# EAGLE schematic calendar-decoders (EAGLE 7.7.0)
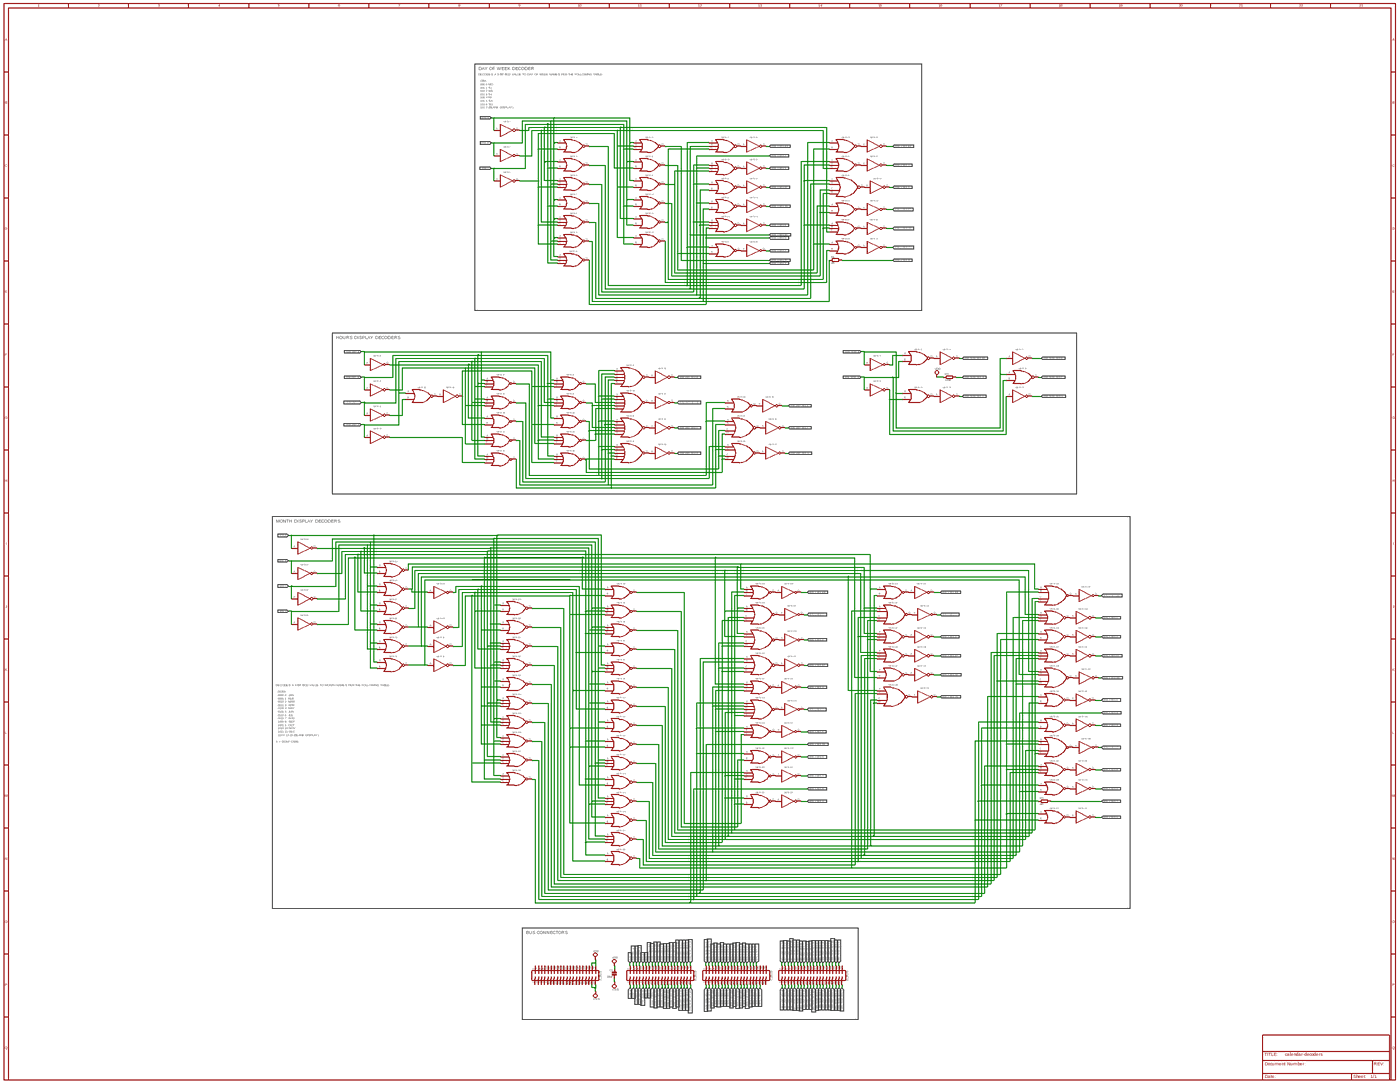
[diagram p0: schematic, sheet 1, overview]
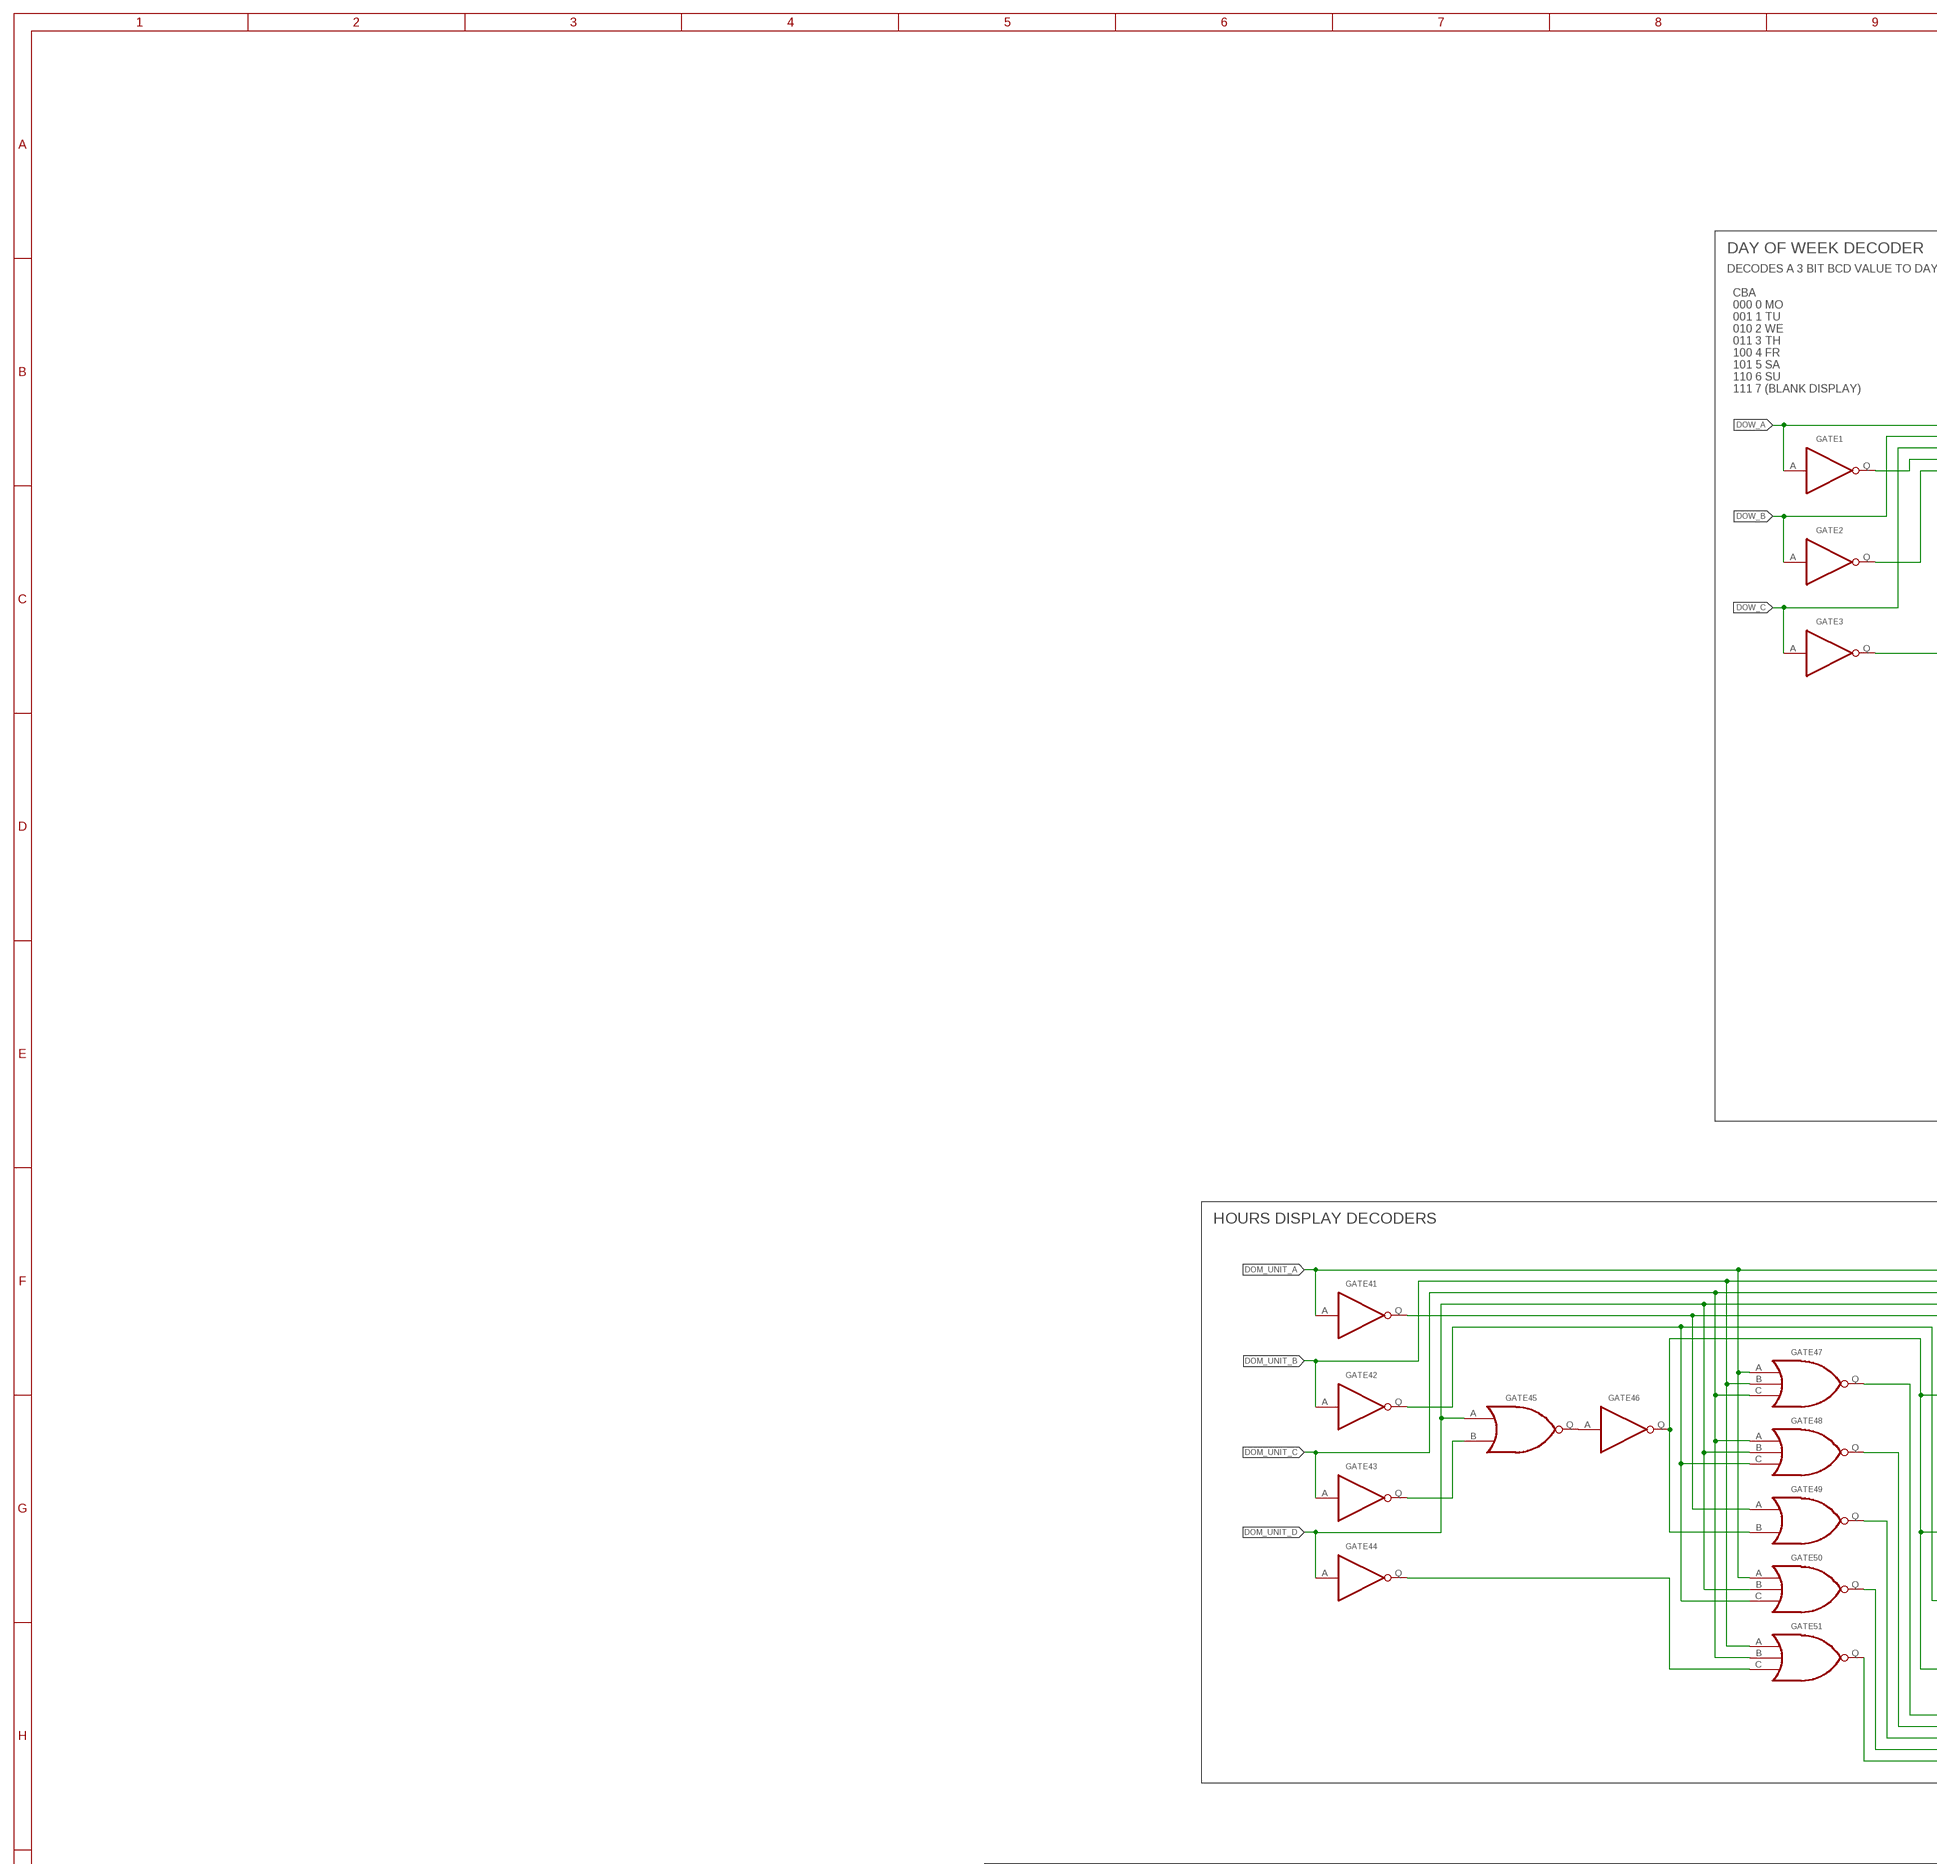
[diagram p1: schematic, sheet 1, part 1 of 6]
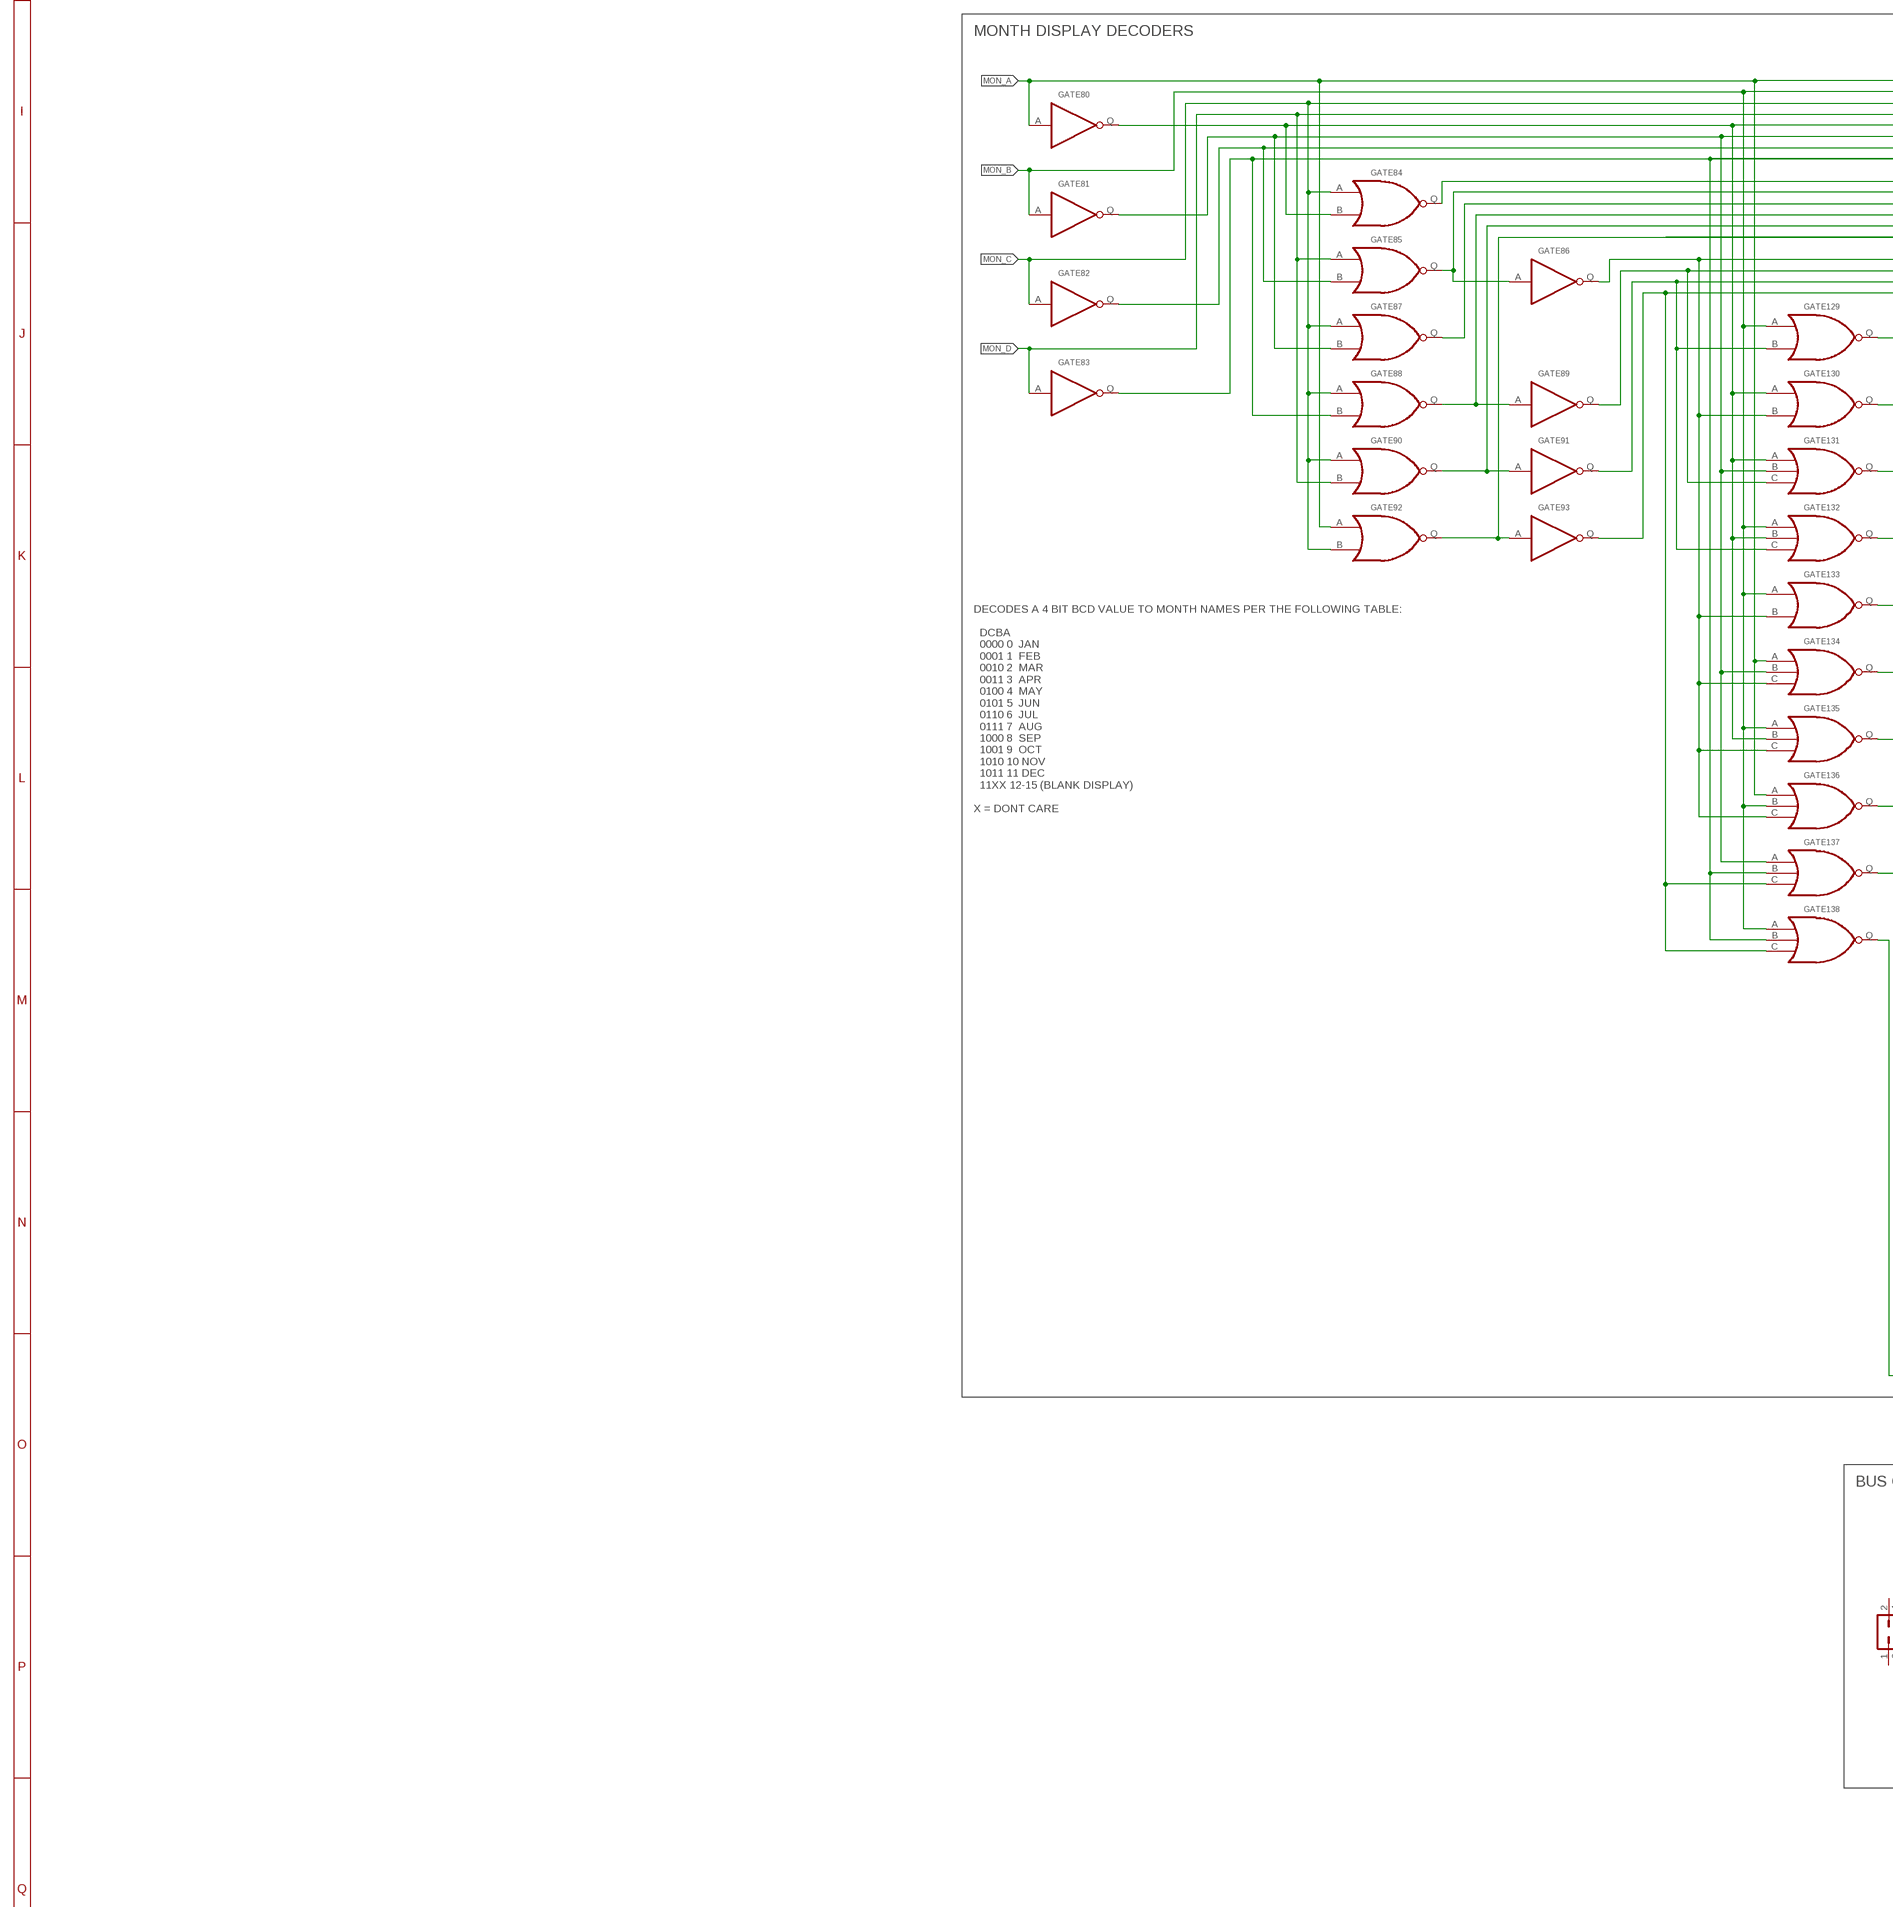
[diagram p2: schematic, sheet 1, part 2 of 6]
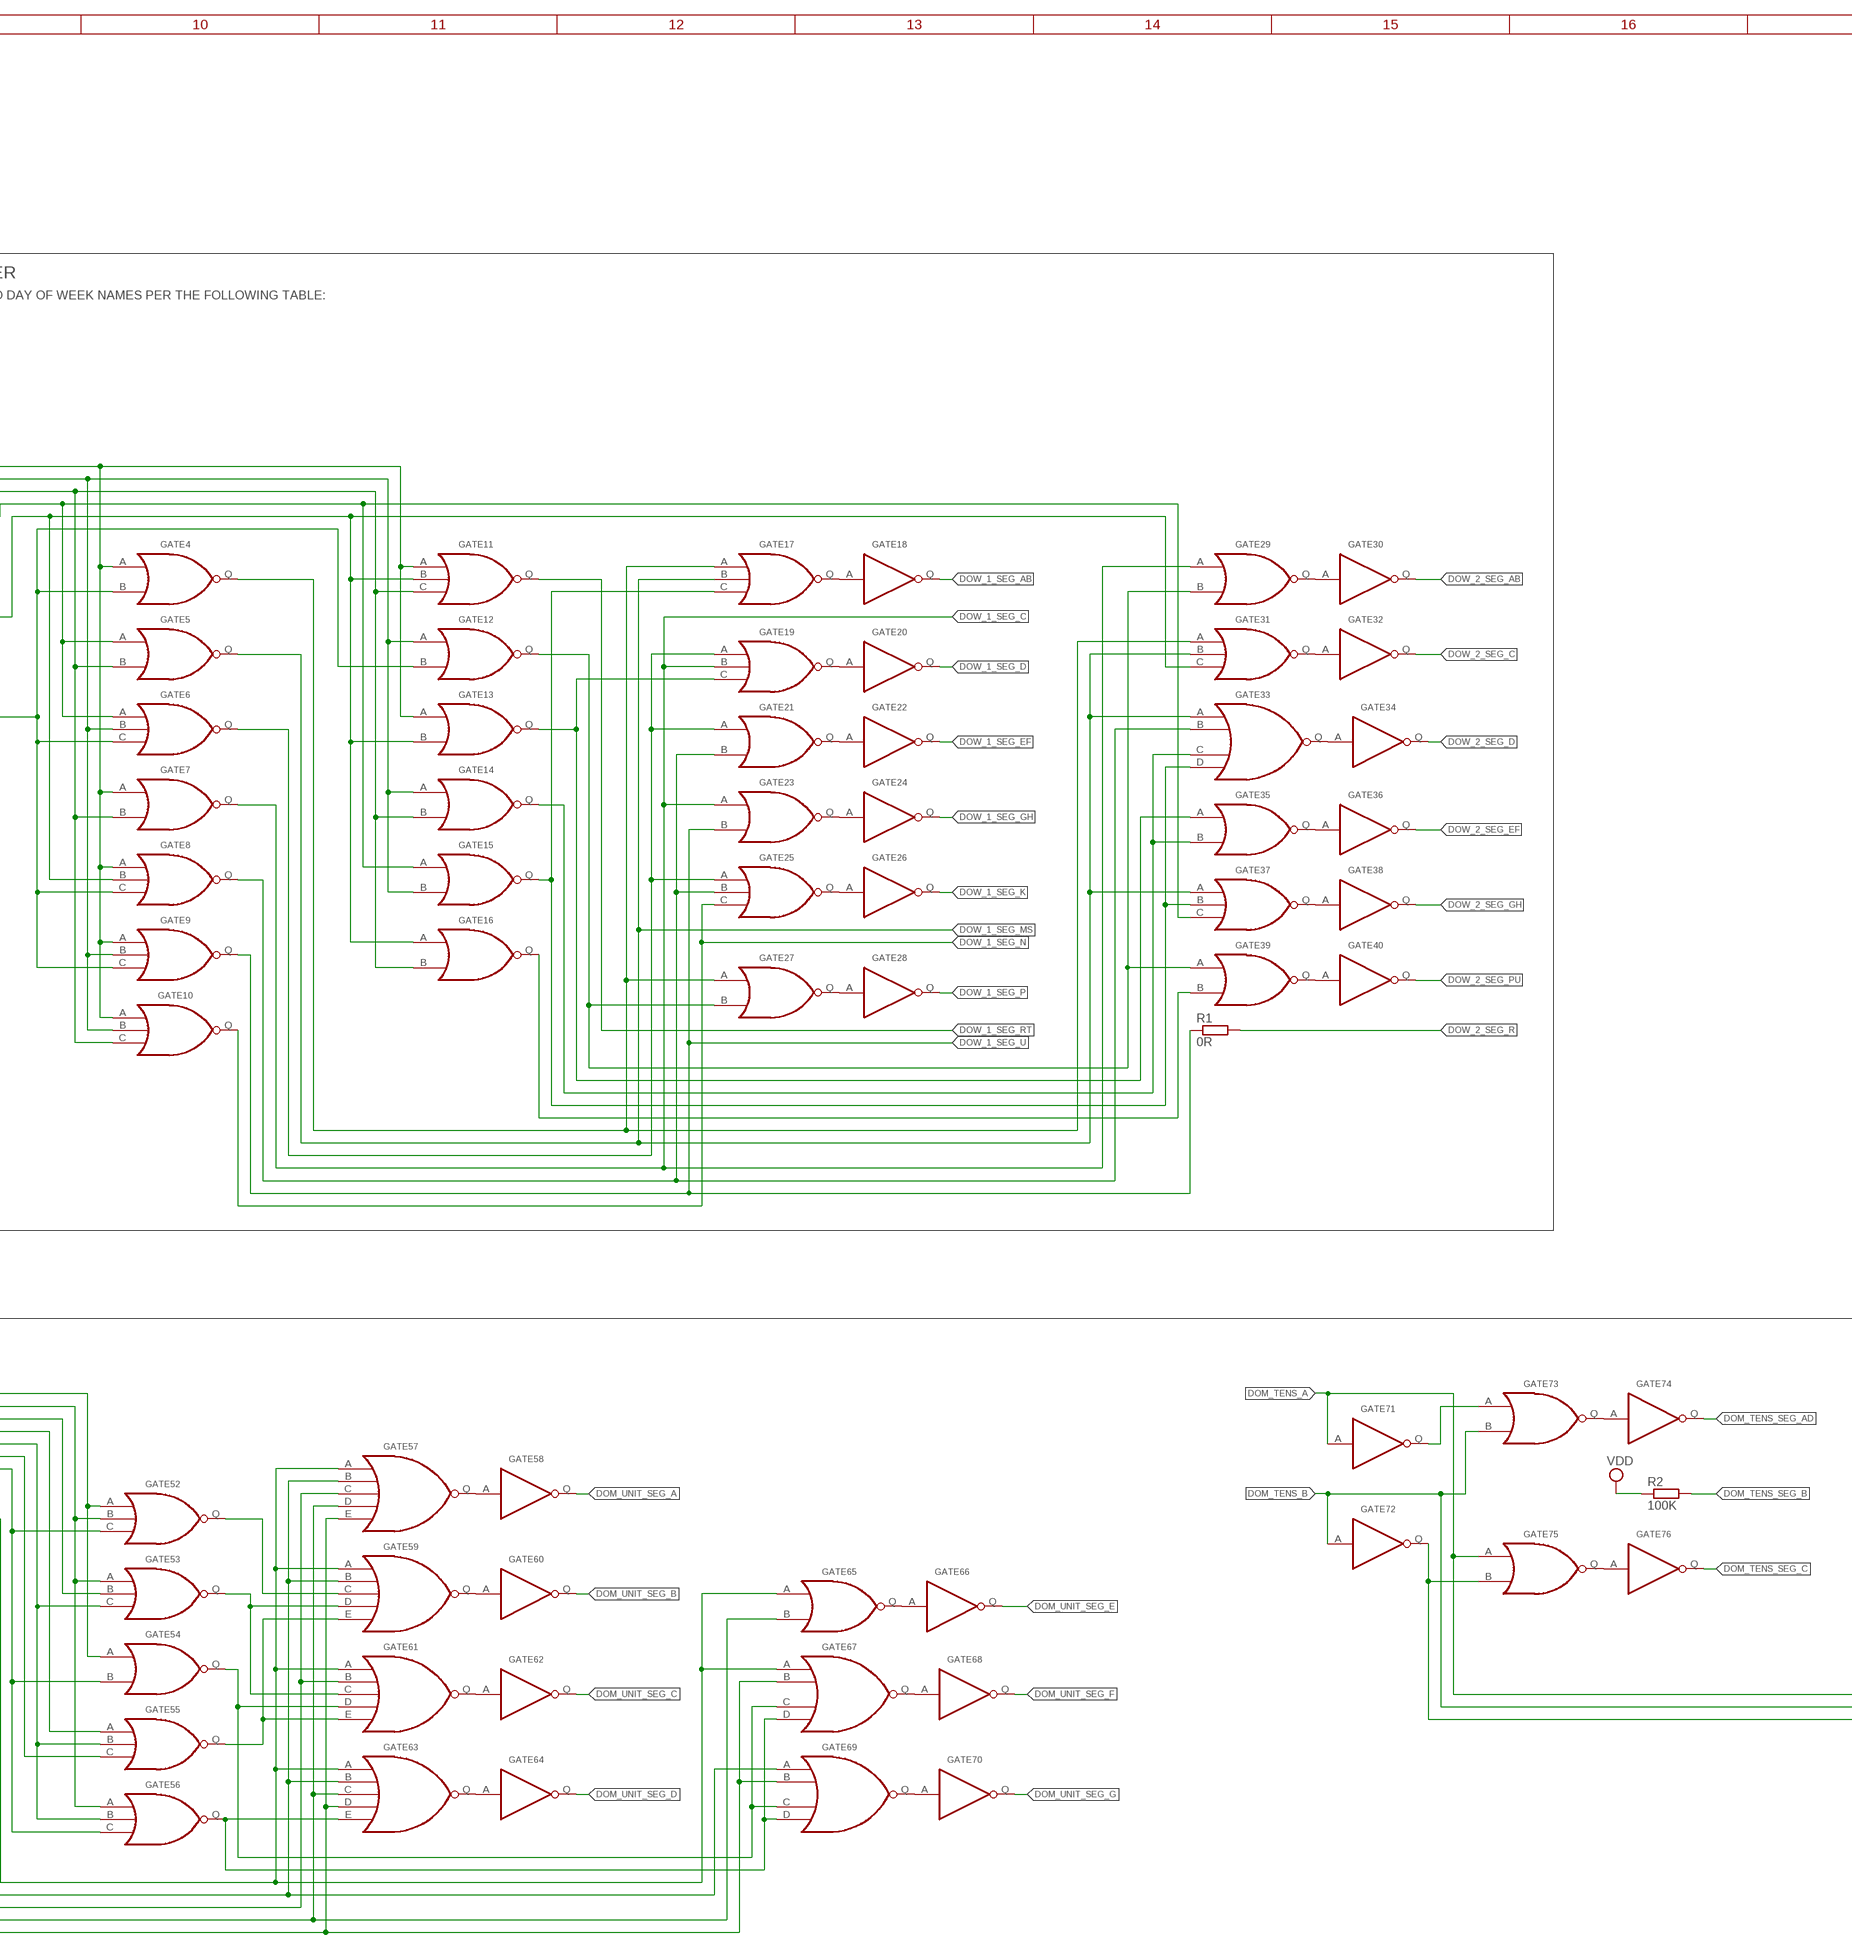
[diagram p3: schematic, sheet 1, part 3 of 6]
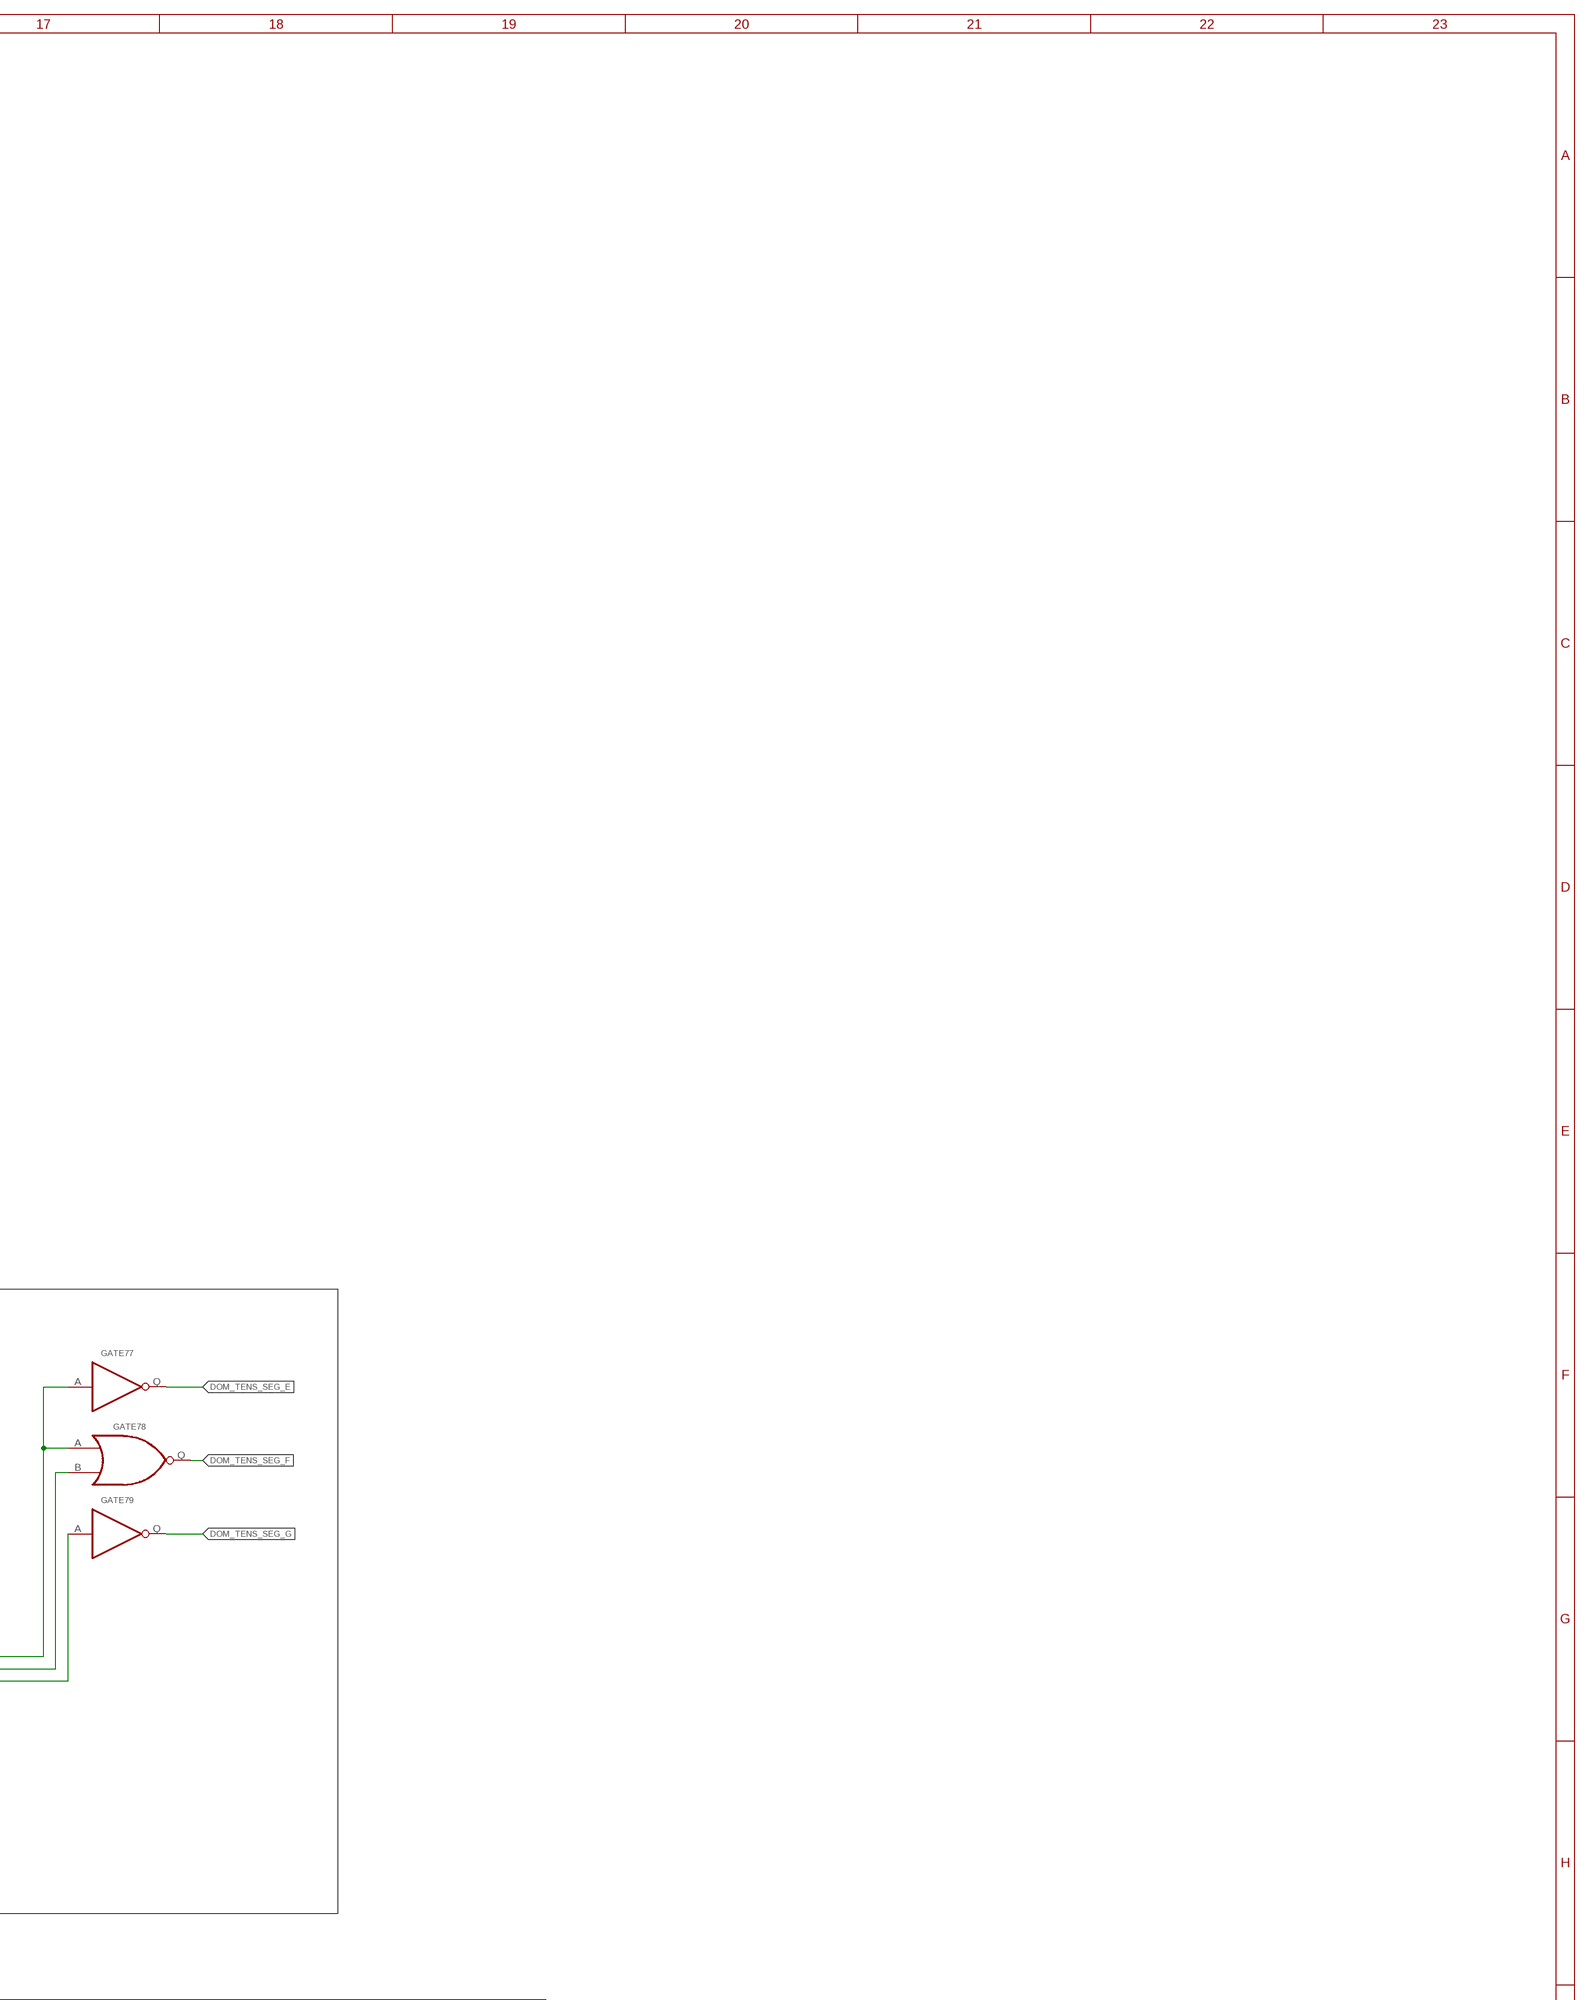
[diagram p4: schematic, sheet 1, part 4 of 6]
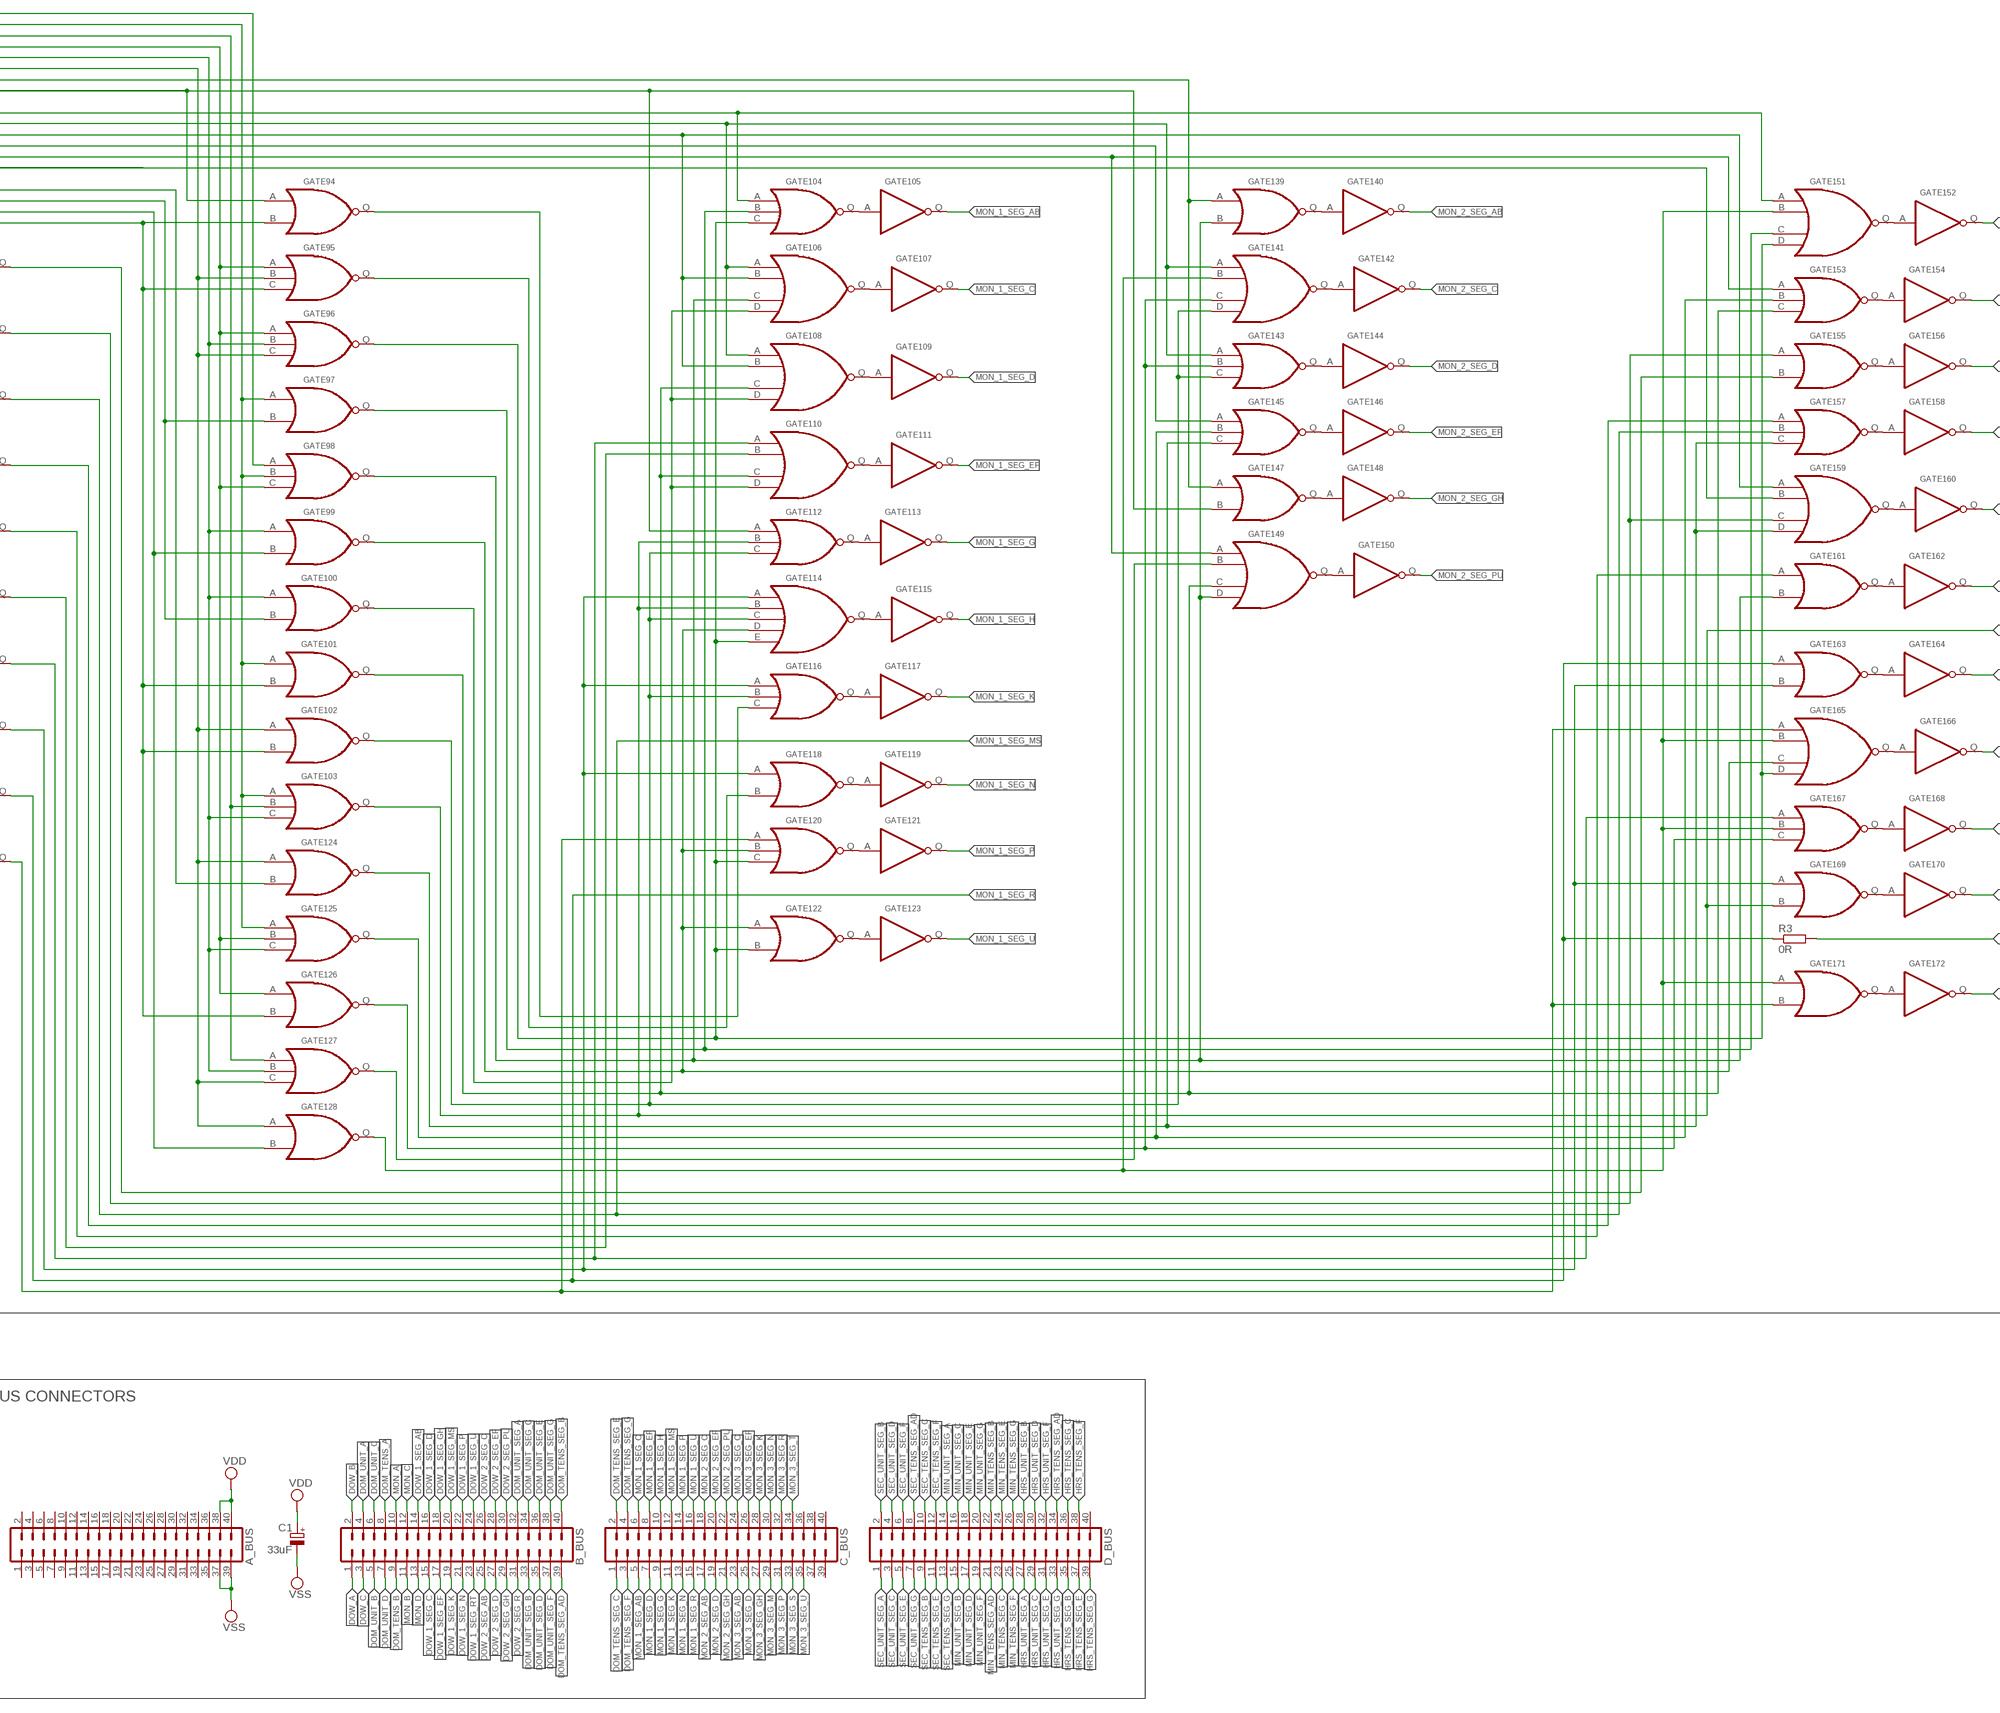
[diagram p5: schematic, sheet 1, part 5 of 6]
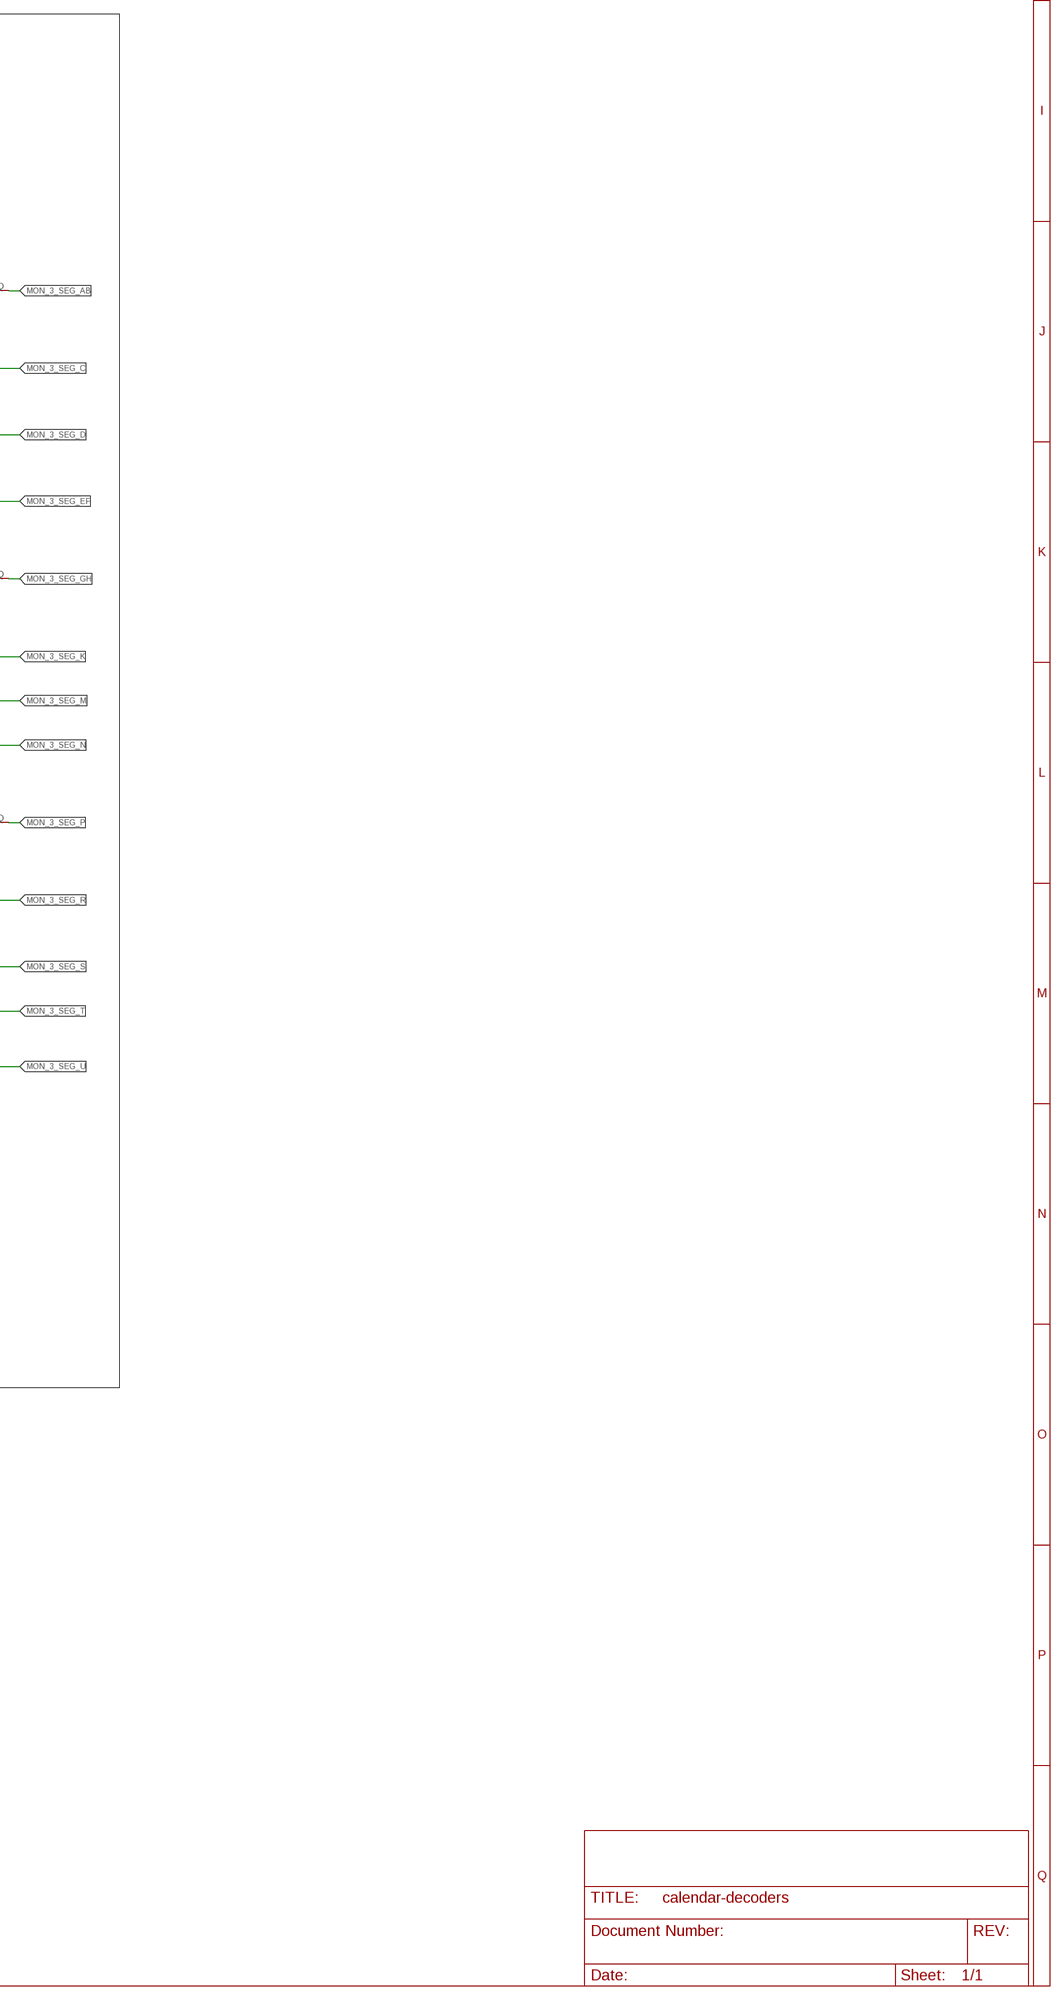
[diagram p6: schematic, sheet 1, part 6 of 6]

## Parts
A_BUS  MA20-2  [MA20-2]
B_BUS  MA20-2  [MA20-2]
C1  33uF  CPOL-EUE2.5-6  [E2,5-6]
C_BUS  MA20-2  [MA20-2]
D_BUS  MA20-2  [MA20-2]
GATE1  INVERTER  [INVERTER]
GATE2  INVERTER  [INVERTER]
GATE3  INVERTER  [INVERTER]
GATE4  2NOR  [2NOR]
GATE5  2NOR  [2NOR]
GATE6  3NOR  [3NOR]
GATE7  2NOR  [2NOR]
GATE8  3NOR  [3NOR]
GATE9  3NOR  [3NOR]
GATE10  3NOR  [3NOR]
GATE11  3NOR  [3NOR]
GATE12  2NOR  [2NOR]
GATE13  2NOR  [2NOR]
GATE14  2NOR  [2NOR]
GATE15  2NOR  [2NOR]
GATE16  2NOR  [2NOR]
GATE17  3NOR  [3NOR]
GATE18  INVERTER  [INVERTER]
GATE19  3NOR  [3NOR]
GATE20  INVERTER  [INVERTER]
GATE21  2NOR  [2NOR]
GATE22  INVERTER  [INVERTER]
GATE23  2NOR  [2NOR]
GATE24  INVERTER  [INVERTER]
GATE25  3NOR  [3NOR]
GATE26  INVERTER  [INVERTER]
GATE27  2NOR  [2NOR]
GATE28  INVERTER  [INVERTER]
GATE29  2NOR  [2NOR]
GATE30  INVERTER  [INVERTER]
GATE31  3NOR  [3NOR]
GATE32  INVERTER  [INVERTER]
GATE33  4NOR  [4NOR]
GATE34  INVERTER  [INVERTER]
GATE35  2NOR  [2NOR]
GATE36  INVERTER  [INVERTER]
GATE37  3NOR  [3NOR]
GATE38  INVERTER  [INVERTER]
GATE39  2NOR  [2NOR]
GATE40  INVERTER  [INVERTER]
GATE41  INVERTER  [INVERTER]
GATE42  INVERTER  [INVERTER]
GATE43  INVERTER  [INVERTER]
GATE44  INVERTER  [INVERTER]
GATE45  2NOR  [2NOR]
GATE46  INVERTER  [INVERTER]
GATE47  3NOR  [3NOR]
GATE48  3NOR  [3NOR]
GATE49  2NOR  [2NOR]
GATE50  3NOR  [3NOR]
GATE51  3NOR  [3NOR]
GATE52  3NOR  [3NOR]
GATE53  3NOR  [3NOR]
GATE54  2NOR  [2NOR]
GATE55  3NOR  [3NOR]
GATE56  3NOR  [3NOR]
GATE57  5NOR  [5NOR]
GATE58  INVERTER  [INVERTER]
GATE59  5NOR  [5NOR]
GATE60  INVERTER  [INVERTER]
GATE61  5NOR  [5NOR]
GATE62  INVERTER  [INVERTER]
GATE63  5NOR  [5NOR]
GATE64  INVERTER  [INVERTER]
GATE65  2NOR  [2NOR]
GATE66  INVERTER  [INVERTER]
GATE67  4NOR  [4NOR]
GATE68  INVERTER  [INVERTER]
GATE69  4NOR  [4NOR]
GATE70  INVERTER  [INVERTER]
GATE71  INVERTER  [INVERTER]
GATE72  INVERTER  [INVERTER]
GATE73  2NOR  [2NOR]
GATE74  INVERTER  [INVERTER]
GATE75  2NOR  [2NOR]
GATE76  INVERTER  [INVERTER]
GATE77  INVERTER  [INVERTER]
GATE78  2NOR  [2NOR]
GATE79  INVERTER  [INVERTER]
GATE80  INVERTER  [INVERTER]
GATE81  INVERTER  [INVERTER]
GATE82  INVERTER  [INVERTER]
GATE83  INVERTER  [INVERTER]
GATE84  2NOR  [2NOR]
GATE85  2NOR  [2NOR]
GATE86  INVERTER  [INVERTER]
GATE87  2NOR  [2NOR]
GATE88  2NOR  [2NOR]
GATE89  INVERTER  [INVERTER]
GATE90  2NOR  [2NOR]
GATE91  INVERTER  [INVERTER]
GATE92  2NOR  [2NOR]
GATE93  INVERTER  [INVERTER]
GATE94  2NOR  [2NOR]
GATE95  3NOR  [3NOR]
GATE96  3NOR  [3NOR]
GATE97  2NOR  [2NOR]
GATE98  3NOR  [3NOR]
GATE99  2NOR  [2NOR]
GATE100  2NOR  [2NOR]
GATE101  2NOR  [2NOR]
GATE102  2NOR  [2NOR]
GATE103  3NOR  [3NOR]
GATE104  3NOR  [3NOR]
GATE105  INVERTER  [INVERTER]
GATE106  4NOR  [4NOR]
GATE107  INVERTER  [INVERTER]
GATE108  4NOR  [4NOR]
GATE109  INVERTER  [INVERTER]
GATE110  4NOR  [4NOR]
GATE111  INVERTER  [INVERTER]
GATE112  3NOR  [3NOR]
GATE113  INVERTER  [INVERTER]
GATE114  5NOR  [5NOR]
GATE115  INVERTER  [INVERTER]
GATE116  3NOR  [3NOR]
GATE117  INVERTER  [INVERTER]
GATE118  2NOR  [2NOR]
GATE119  INVERTER  [INVERTER]
GATE120  3NOR  [3NOR]
GATE121  INVERTER  [INVERTER]
GATE122  2NOR  [2NOR]
GATE123  INVERTER  [INVERTER]
GATE124  2NOR  [2NOR]
GATE125  3NOR  [3NOR]
GATE126  2NOR  [2NOR]
GATE127  3NOR  [3NOR]
GATE128  2NOR  [2NOR]
GATE129  2NOR  [2NOR]
GATE130  2NOR  [2NOR]
GATE131  3NOR  [3NOR]
GATE132  3NOR  [3NOR]
GATE133  2NOR  [2NOR]
GATE134  3NOR  [3NOR]
GATE135  3NOR  [3NOR]
GATE136  3NOR  [3NOR]
GATE137  3NOR  [3NOR]
GATE138  3NOR  [3NOR]
GATE139  2NOR  [2NOR]
GATE140  INVERTER  [INVERTER]
GATE141  4NOR  [4NOR]
GATE142  INVERTER  [INVERTER]
GATE143  3NOR  [3NOR]
GATE144  INVERTER  [INVERTER]
GATE145  3NOR  [3NOR]
GATE146  INVERTER  [INVERTER]
GATE147  2NOR  [2NOR]
GATE148  INVERTER  [INVERTER]
GATE149  4NOR  [4NOR]
GATE150  INVERTER  [INVERTER]
GATE151  4NOR  [4NOR]
GATE152  INVERTER  [INVERTER]
GATE153  3NOR  [3NOR]
GATE154  INVERTER  [INVERTER]
GATE155  2NOR  [2NOR]
GATE156  INVERTER  [INVERTER]
GATE157  3NOR  [3NOR]
GATE158  INVERTER  [INVERTER]
GATE159  4NOR  [4NOR]
GATE160  INVERTER  [INVERTER]
GATE161  2NOR  [2NOR]
GATE162  INVERTER  [INVERTER]
GATE163  2NOR  [2NOR]
GATE164  INVERTER  [INVERTER]
GATE165  4NOR  [4NOR]
GATE166  INVERTER  [INVERTER]
GATE167  3NOR  [3NOR]
GATE168  INVERTER  [INVERTER]
GATE169  2NOR  [2NOR]
GATE170  INVERTER  [INVERTER]
GATE171  2NOR  [2NOR]
GATE172  INVERTER  [INVERTER]
R1  0R  R-EU_0207/2V  [0207/2V]
R2  100K  R-EU_0207/2V  [0207/2V]
R3  0R  R-EU_0207/2V  [0207/2V]

## Nets
DOM_TENS_A: B_BUS.8 GATE71.A GATE75.A GATE77.A GATE78.A
DOM_TENS_B: B_BUS.9 GATE72.A GATE73.B GATE78.B
DOM_TENS_SEG_AD: B_BUS.39 GATE74.Q
DOM_TENS_SEG_B: B_BUS.40 R2.2
DOM_TENS_SEG_C: C_BUS.1 GATE76.Q
DOM_TENS_SEG_E: C_BUS.2 GATE77.Q
DOM_TENS_SEG_F: C_BUS.3 GATE78.Q
DOM_TENS_SEG_G: C_BUS.4 GATE79.Q
DOM_UNIT_A: B_BUS.4 GATE41.A GATE47.A GATE50.A GATE52.A GATE54.A
DOM_UNIT_B: B_BUS.5 GATE42.A GATE47.B GATE51.A GATE52.B GATE53.A GATE56.A
DOM_UNIT_C: B_BUS.6 GATE43.A GATE47.C GATE48.A GATE51.B GATE53.B
DOM_UNIT_D: B_BUS.7 GATE44.A GATE45.A GATE48.B GATE50.B GATE55.A
DOM_UNIT_SEG_A: B_BUS.32 GATE58.Q
DOM_UNIT_SEG_B: B_BUS.33 GATE60.Q
DOM_UNIT_SEG_C: B_BUS.34 GATE62.Q
DOM_UNIT_SEG_D: B_BUS.35 GATE64.Q
DOM_UNIT_SEG_E: B_BUS.36 GATE66.Q
DOM_UNIT_SEG_F: B_BUS.37 GATE68.Q
DOM_UNIT_SEG_G: B_BUS.38 GATE70.Q
DOW_1_SEG_AB: B_BUS.14 GATE18.Q
DOW_1_SEG_C: B_BUS.15 GATE7.Q GATE19.B GATE23.A GATE29.A
DOW_1_SEG_D: B_BUS.16 GATE20.Q
DOW_1_SEG_EF: B_BUS.17 GATE22.Q
DOW_1_SEG_GH: B_BUS.18 GATE24.Q
DOW_1_SEG_K: B_BUS.19 GATE26.Q
DOW_1_SEG_MS: B_BUS.20 GATE5.Q GATE17.B GATE31.B GATE33.A GATE37.A
DOW_1_SEG_N: B_BUS.21 GATE10.Q GATE25.C
DOW_1_SEG_P: B_BUS.22 GATE28.Q
DOW_1_SEG_RT: B_BUS.23 GATE11.Q
DOW_1_SEG_U: B_BUS.24 GATE9.Q GATE23.B R1.1
DOW_2_SEG_AB: B_BUS.25 GATE30.Q
DOW_2_SEG_C: B_BUS.26 GATE32.Q
DOW_2_SEG_D: B_BUS.27 GATE34.Q
DOW_2_SEG_EF: B_BUS.28 GATE36.Q
DOW_2_SEG_GH: B_BUS.29 GATE38.Q
DOW_2_SEG_PU: B_BUS.30 GATE40.Q
DOW_2_SEG_R: B_BUS.31 R1.2
DOW_A: B_BUS.1 GATE1.A GATE4.A GATE7.A GATE8.A GATE9.A GATE10.A GATE11.A GATE13.A
DOW_B: B_BUS.2 GATE2.A GATE6.B GATE9.B GATE10.B GATE12.A GATE14.A GATE15.B
DOW_C: B_BUS.3 GATE3.A GATE5.B GATE7.B GATE10.C GATE11.C GATE14.B GATE16.B
HRS_TENS_SEG_AD: D_BUS.34
HRS_TENS_SEG_B: D_BUS.35
HRS_TENS_SEG_C: D_BUS.36
HRS_TENS_SEG_E: D_BUS.37
HRS_TENS_SEG_F: D_BUS.38
HRS_TENS_SEG_G: D_BUS.39
HRS_UNIT_SEG_A: D_BUS.27
HRS_UNIT_SEG_B: D_BUS.28
HRS_UNIT_SEG_C: D_BUS.29
HRS_UNIT_SEG_D: D_BUS.30
HRS_UNIT_SEG_E: D_BUS.31
HRS_UNIT_SEG_F: D_BUS.32
HRS_UNIT_SEG_G: D_BUS.33
MIN_TENS_SEG_AD: D_BUS.21
MIN_TENS_SEG_B: D_BUS.22
MIN_TENS_SEG_C: D_BUS.23
MIN_TENS_SEG_E: D_BUS.24
MIN_TENS_SEG_F: D_BUS.25
MIN_TENS_SEG_G: D_BUS.26
MIN_UNIT_SEG_A: D_BUS.14
MIN_UNIT_SEG_B: D_BUS.15
MIN_UNIT_SEG_C: D_BUS.16
MIN_UNIT_SEG_D: D_BUS.17
MIN_UNIT_SEG_E: D_BUS.18
MIN_UNIT_SEG_F: D_BUS.19
MIN_UNIT_SEG_G: D_BUS.20
MON_1_SEG_AB: C_BUS.5 GATE105.Q
MON_1_SEG_C: C_BUS.6 GATE107.Q
MON_1_SEG_D: C_BUS.7 GATE109.Q
MON_1_SEG_EF: C_BUS.8 GATE111.Q
MON_1_SEG_G: C_BUS.9 GATE113.Q
MON_1_SEG_H: C_BUS.10 GATE115.Q
MON_1_SEG_K: C_BUS.11 GATE117.Q
MON_1_SEG_MS: C_BUS.12 GATE131.Q GATE157.B
MON_1_SEG_N: C_BUS.13 GATE119.Q
MON_1_SEG_P: C_BUS.14 GATE121.Q
MON_1_SEG_R: C_BUS.15 GATE137.Q GATE163.A R3.1
MON_1_SEG_U: C_BUS.16 GATE123.Q
MON_2_SEG_AB: C_BUS.17 GATE140.Q
MON_2_SEG_C: C_BUS.18 GATE142.Q
MON_2_SEG_D: C_BUS.19 GATE144.Q
MON_2_SEG_EF: C_BUS.20 GATE146.Q
MON_2_SEG_GH: C_BUS.21 GATE148.Q
MON_2_SEG_PU: C_BUS.22 GATE150.Q
MON_3_SEG_AB: C_BUS.23 GATE152.Q
MON_3_SEG_C: C_BUS.24 GATE154.Q
MON_3_SEG_D: C_BUS.25 GATE156.Q
MON_3_SEG_EF: C_BUS.26 GATE158.Q
MON_3_SEG_GH: C_BUS.27 GATE160.Q
MON_3_SEG_K: C_BUS.28 GATE162.Q
MON_3_SEG_M: C_BUS.29 GATE103.Q GATE112.B GATE114.B GATE169.B
MON_3_SEG_N: C_BUS.30 GATE164.Q
MON_3_SEG_P: C_BUS.31 GATE166.Q
MON_3_SEG_R: C_BUS.32 GATE168.Q
MON_3_SEG_S: C_BUS.33 GATE170.Q
MON_3_SEG_T: C_BUS.34 R3.2
MON_3_SEG_U: C_BUS.35 GATE172.Q
MON_A: B_BUS.10 GATE80.A GATE92.A GATE98.A GATE134.A GATE136.A
MON_B: B_BUS.11 GATE81.A GATE97.A GATE98.B GATE101.A GATE103.A GATE125.A GATE129.A GATE132.A GATE133.A GATE135.A GATE136.B GATE138.A
MON_C: B_BUS.12 GATE82.A GATE84.A GATE87.A GATE88.A GATE90.A GATE92.B GATE103.B GATE127.A
MON_D: B_BUS.13 GATE83.A GATE85.A GATE90.B GATE95.A GATE96.A GATE98.C GATE125.B GATE126.A
N$1: GATE3.Q GATE4.B GATE6.C GATE8.C GATE9.C GATE12.B
N$2: GATE45.Q GATE46.A
N$3: GATE57.Q GATE58.A
N$4: GATE1.Q GATE5.A GATE6.A GATE15.A GATE37.C
N$5: GATE2.Q GATE8.B GATE11.B GATE13.B GATE16.A GATE31.C
N$6: GATE8.Q GATE21.B GATE25.B GATE33.B
N$7: GATE12.Q GATE27.B GATE29.B GATE39.A
N$8: GATE6.Q GATE19.A GATE21.A GATE25.A
N$9: GATE59.Q GATE60.A
N$10: GATE4.Q GATE17.A GATE27.A GATE31.A
N$11: GATE16.Q GATE39.B
N$12: GATE15.Q GATE17.C GATE33.D GATE37.B
N$13: GATE14.Q GATE33.C GATE35.B
N$14: GATE13.Q GATE19.C GATE35.A
N$15: GATE61.Q GATE62.A
N$16: GATE63.Q GATE64.A
N$17: GATE17.Q GATE18.A
N$18: GATE19.Q GATE20.A
N$19: GATE21.Q GATE22.A
N$20: GATE23.Q GATE24.A
N$21: GATE25.Q GATE26.A
N$22: GATE27.Q GATE28.A
N$23: GATE29.Q GATE30.A
N$24: GATE31.Q GATE32.A
N$25: GATE33.Q GATE34.A
N$26: GATE35.Q GATE36.A
N$27: GATE37.Q GATE38.A
N$28: GATE39.Q GATE40.A
N$29: GATE65.Q GATE66.A
N$30: GATE67.Q GATE68.A
N$31: GATE69.Q GATE70.A
N$32: GATE73.Q GATE74.A
N$33: GATE75.Q GATE76.A
N$34: GATE93.Q GATE94.B GATE95.C GATE101.B GATE102.B GATE126.B GATE137.C GATE138.C
N$35: GATE91.Q GATE99.B GATE128.B GATE129.B GATE132.C
N$36: GATE90.Q GATE91.A GATE149.A GATE153.A
N$37: GATE92.Q GATE93.A GATE159.B
N$38: GATE104.Q GATE105.A
N$39: GATE106.Q GATE107.A
N$40: GATE108.Q GATE109.A
N$41: GATE110.Q GATE111.A
N$42: GATE80.Q GATE84.B GATE96.B GATE99.A GATE100.A GATE103.C GATE125.C GATE127.B GATE130.A GATE131.A GATE132.B GATE135.B
N$43: GATE81.Q GATE87.B GATE95.B GATE96.C GATE102.A GATE124.A GATE127.C GATE128.A GATE131.B GATE134.B GATE137.A
N$44: GATE82.Q GATE85.B GATE139.A GATE147.A
N$45: GATE83.Q GATE88.B GATE94.A GATE112.A GATE137.B GATE138.B GATE147.B
N$46: GATE84.Q GATE104.A GATE151.A
N$47: GATE85.Q GATE86.A GATE106.A GATE108.A GATE141.A GATE143.A
N$48: GATE87.Q GATE106.B GATE108.B GATE159.A
N$49: GATE88.Q GATE89.A GATE145.A
N$51: GATE86.Q GATE124.B GATE130.B GATE133.B GATE134.C GATE135.C GATE136.C
N$52: GATE112.Q GATE113.A
N$53: GATE114.Q GATE115.A
N$54: GATE116.Q GATE117.A
N$55: GATE118.Q GATE119.A
N$56: GATE120.Q GATE121.A
N$57: GATE122.Q GATE123.A
N$58: GATE124.Q GATE145.C GATE157.C GATE159.D
N$59: GATE125.Q GATE145.B GATE153.B
N$60: GATE126.Q GATE141.C GATE143.B GATE167.C
N$61: GATE127.Q GATE149.B
N$62: GATE128.Q GATE141.B GATE151.B GATE165.B GATE167.B GATE171.A
N$63: GATE120.A GATE138.Q GATE165.A GATE171.B
N$64: GATE89.Q GATE97.B GATE100.B GATE131.C
N$65: GATE114.A GATE116.A GATE118.A GATE136.Q GATE163.B GATE169.A
N$66: GATE110.A GATE135.Q GATE167.A
N$67: GATE110.B GATE134.Q
N$68: GATE133.Q GATE161.A
N$69: GATE132.Q GATE157.A
N$71: GATE102.Q GATE112.C GATE114.C GATE116.B GATE141.D GATE143.C
N$72: GATE101.Q GATE108.C GATE110.C GATE149.C GATE153.C
N$73: GATE100.Q GATE106.D GATE108.D GATE110.D
N$74: GATE99.Q GATE114.D GATE120.B GATE122.A GATE165.C
N$75: GATE98.Q GATE106.C GATE139.B GATE149.D GATE161.B
N$76: GATE97.Q GATE104.B GATE151.C
N$77: GATE96.Q GATE104.C GATE114.E GATE120.C GATE122.B GATE151.D GATE165.D
N$78: GATE95.Q GATE118.B
N$79: GATE94.Q GATE116.C
N$80: GATE151.Q GATE152.A
N$81: GATE130.Q GATE155.A GATE159.C
N$82: GATE129.Q GATE155.B
N$83: GATE139.Q GATE140.A
N$84: GATE141.Q GATE142.A
N$85: GATE41.Q GATE49.A GATE53.C GATE55.B GATE56.B
N$86: GATE42.Q GATE48.C GATE50.C GATE55.C
N$87: GATE43.Q GATE45.B
N$88: GATE44.Q GATE51.C
N$89: GATE143.Q GATE144.A
N$90: GATE46.Q GATE49.B GATE52.C GATE54.B GATE56.C
N$91: GATE51.Q GATE57.E GATE63.D GATE67.B GATE69.B
N$92: GATE50.Q GATE57.D GATE63.C GATE65.B
N$93: GATE49.Q GATE57.C GATE61.B
N$94: GATE48.Q GATE57.B GATE59.B GATE63.B GATE69.A
N$95: GATE47.Q GATE57.A GATE59.A GATE61.A GATE63.A GATE65.A GATE67.A
N$96: GATE53.Q GATE59.D GATE61.C
N$97: GATE54.Q GATE61.D GATE67.C GATE69.C
N$98: GATE55.Q GATE59.E GATE61.E
N$99: GATE56.Q GATE63.E GATE67.D GATE69.D
N$100: GATE52.Q GATE59.C
N$101: GATE145.Q GATE146.A
N$102: GATE147.Q GATE148.A
N$103: GATE149.Q GATE150.A
N$104: GATE153.Q GATE154.A
N$105: GATE155.Q GATE156.A
N$106: GATE157.Q GATE158.A
N$107: GATE159.Q GATE160.A
N$108: GATE71.Q GATE73.A
N$109: GATE72.Q GATE75.B GATE79.A
N$110: GATE161.Q GATE162.A
N$111: GATE163.Q GATE164.A
N$112: GATE165.Q GATE166.A
N$113: GATE167.Q GATE168.A
N$114: GATE169.Q GATE170.A
N$115: GATE171.Q GATE172.A
SEC_TENS_SEG_AD: D_BUS.8
SEC_TENS_SEG_B: D_BUS.9
SEC_TENS_SEG_C: D_BUS.10
SEC_TENS_SEG_E: D_BUS.11
SEC_TENS_SEG_F: D_BUS.12
SEC_TENS_SEG_G: D_BUS.13
SEC_UNIT_SEG_A: D_BUS.1
SEC_UNIT_SEG_B: D_BUS.2
SEC_UNIT_SEG_C: D_BUS.3
SEC_UNIT_SEG_D: D_BUS.4
SEC_UNIT_SEG_E: D_BUS.5
SEC_UNIT_SEG_F: D_BUS.6
SEC_UNIT_SEG_G: D_BUS.7
VDD: A_BUS.38 A_BUS.40 C1.+ R2.1
VSS: A_BUS.37 A_BUS.39 C1.-
Unconnected: A_BUS.1 A_BUS.2 A_BUS.3 A_BUS.4 A_BUS.5 A_BUS.6 A_BUS.7 A_BUS.8 A_BUS.9 A_BUS.10 A_BUS.11 A_BUS.12 A_BUS.13 A_BUS.14 A_BUS.15 A_BUS.16 A_BUS.17 A_BUS.18 A_BUS.19 A_BUS.20 A_BUS.21 A_BUS.22 A_BUS.23 A_BUS.24 A_BUS.25 A_BUS.26 A_BUS.27 A_BUS.28 A_BUS.29 A_BUS.30 A_BUS.31 A_BUS.32 A_BUS.33 A_BUS.34 A_BUS.35 A_BUS.36 C_BUS.36 C_BUS.37 C_BUS.38 C_BUS.39 C_BUS.40 D_BUS.40

## Notes on the sheet
- DAY OF WEEK DECODER
- DECODES A 3 BIT BCD VALUE TO DAY OF WEEK NAMES PER THE FOLLOWING TABLE:
  
    CBA
    000 0 MO
    001 1 TU
    010 2 WE
    011 3 TH
    100 4 FR
    101 5 SA
    110 6 SU
    111 7 (BLANK DISPLAY)
- HOURS DISPLAY DECODERS
- MONTH DISPLAY DECODERS
- DECODES A 4 BIT BCD VALUE TO MONTH NAMES PER THE FOLLOWING TABLE:
  
    DCBA
    0000 0  JAN
    0001 1  FEB
    0010 2  MAR
    0011 3  APR
    0100 4  MAY
    0101 5  JUN
    0110 6  JUL
    0111 7  AUG
    1000 8  SEP
    1001 9  OCT
    1010 10 NOV
    1011 11 DEC
    11XX 12-15 (BLANK DISPLAY)
  
  X = DONT CARE
- BUS CONNECTORS

## Library data of the parts
A_BUS B_BUS C_BUS D_BUS = con-lstb:MA20-2: PIN HEADER; OC_FARNELL: unknown; OC_NEWARK: unknown
C1 = rcl:CPOL-EU: POLARIZED CAPACITOR, European symbol
GATE1-GATE3 GATE18 GATE20 GATE22 GATE24 GATE26 GATE28 GATE30 GATE32 GATE34 GATE36 GATE38 GATE40-GATE44 GATE46 GATE58 GATE60 GATE62 GATE64 GATE66 GATE68 GATE70-GATE72 GATE74 GATE76 GATE77 GATE79-GATE83 GATE86 GATE89 GATE91 GATE93 GATE105 GATE107 GATE109 GATE111 GATE113 GATE115 GATE117 GATE119 GATE121 GATE123 GATE140 GATE142 GATE144 GATE146 GATE148 GATE150 GATE152 GATE154 GATE156 GATE158 GATE160 GATE162 GATE164 GATE166 GATE168 GATE170 GATE172 = NOR gate clock:INVERTER
GATE4 GATE5 GATE7 GATE12-GATE16 GATE21 GATE23 GATE27 GATE29 GATE35 GATE39 GATE45 GATE49 GATE54 GATE65 GATE73 GATE75 GATE78 GATE84 GATE85 GATE87 GATE88 GATE90 GATE92 GATE94 GATE97 GATE99-GATE102 GATE118 GATE122 GATE124 GATE126 GATE128-GATE130 GATE133 GATE139 GATE147 GATE155 GATE161 GATE163 GATE169 GATE171 = NOR gate clock:2NOR
GATE6 GATE8-GATE11 GATE17 GATE19 GATE25 GATE31 GATE37 GATE47 GATE48 GATE50-GATE53 GATE55 GATE56 GATE95 GATE96 GATE98 GATE103 GATE104 GATE112 GATE116 GATE120 GATE125 GATE127 GATE131 GATE132 GATE134-GATE138 GATE143 GATE145 GATE153 GATE157 GATE167 = NOR gate clock:3NOR
GATE33 GATE67 GATE69 GATE106 GATE108 GATE110 GATE141 GATE149 GATE151 GATE159 GATE165 = NOR gate clock:4NOR
GATE57 GATE59 GATE61 GATE63 GATE114 = NOR gate clock:5NOR
R1-R3 = NOR gate clock:R-EU_